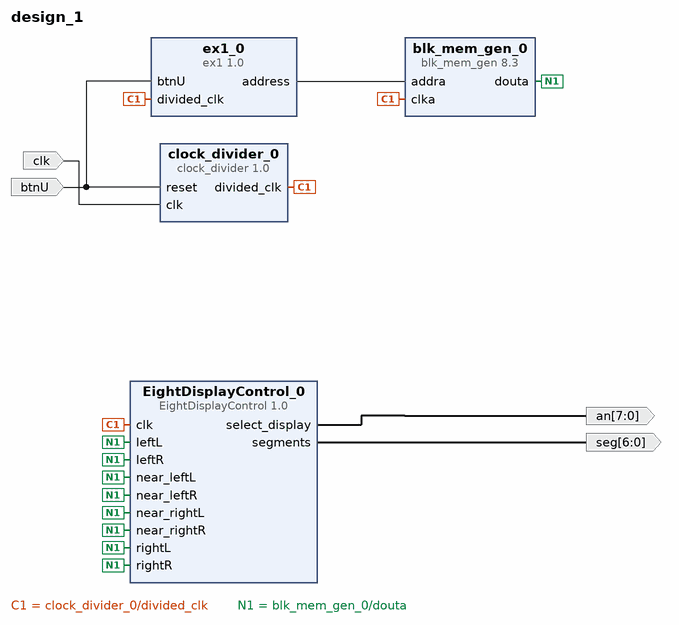
[diagram p0: block diagram of the top level]
# Vivado block design design_1, xc7a100tcsg324-1, Vivado 2016.4
create_bd_design design_1

create_bd_port -dir I -type clk clk
set_property -dict {CONFIG.FREQ_HZ 1} [get_bd_ports clk]
create_bd_port -dir O -from 7 -to 0 an
create_bd_port -dir O -from 6 -to 0 seg
create_bd_port -dir I -type rst btnU
set_property -dict {CONFIG.POLARITY ACTIVE_HIGH} [get_bd_ports btnU]

create_bd_cell -type ip -vlnv xilinx.com:ip:blk_mem_gen:8.3 blk_mem_gen_0
set_property -dict [list \
  CONFIG.Memory_Type Single_Port_ROM \
  CONFIG.Enable_32bit_Address false \
  CONFIG.Enable_A Always_Enabled \
  CONFIG.Register_PortA_Output_of_Memory_Primitives true \
  CONFIG.Load_Init_File true \
  CONFIG.Coe_File ../../../../../../../../../Aula3/Aula3_estudo_ex4/coe/aula4_ex1.coe \
  CONFIG.Use_RSTA_Pin false \
  CONFIG.Port_A_Write_Rate 0 \
  CONFIG.use_bram_block Stand_Alone \
] [get_bd_cells blk_mem_gen_0]
create_bd_cell -type ip -vlnv xilinx.com:user:clock_divider:1.0 clock_divider_0
create_bd_cell -type ip -vlnv xilinx.com:user:EightDisplayControl:1.0 EightDisplayControl_0
create_bd_cell -type ip -vlnv xilinx.com:user:ex1:1.0 ex1_0

# ---- connections ----

connect_bd_net [get_bd_ports clk] [get_bd_pins clock_divider_0/clk]
connect_bd_net [get_bd_pins clock_divider_0/divided_clk] \
  [get_bd_pins EightDisplayControl_0/clk] [get_bd_pins blk_mem_gen_0/clka] [get_bd_pins ex1_0/divided_clk]
connect_bd_net [get_bd_pins blk_mem_gen_0/douta] \
  [get_bd_pins EightDisplayControl_0/rightR] [get_bd_pins EightDisplayControl_0/near_rightR] \
  [get_bd_pins EightDisplayControl_0/near_leftR] [get_bd_pins EightDisplayControl_0/leftR] \
  [get_bd_pins EightDisplayControl_0/rightL] [get_bd_pins EightDisplayControl_0/near_rightL] \
  [get_bd_pins EightDisplayControl_0/near_leftL] [get_bd_pins EightDisplayControl_0/leftL]
connect_bd_net [get_bd_pins EightDisplayControl_0/select_display] [get_bd_ports an]
connect_bd_net [get_bd_pins EightDisplayControl_0/segments] [get_bd_ports seg]
connect_bd_net [get_bd_ports btnU] [get_bd_pins clock_divider_0/reset] [get_bd_pins ex1_0/btnU]
connect_bd_net [get_bd_pins ex1_0/address] [get_bd_pins blk_mem_gen_0/addra]

validate_bd_design
save_bd_design
